# EasyEDA Pro project ID PCB.epro

# Schematic Schematic1
Board Name: Board1; Create Date: 2026-03-27; Page Name: P1; Project Name: ID PCB; Schematic Name: Schematic1; Update Date: 2026-03-29; Company: EasyEDA.com; Page Size: A4; Version: V1.0
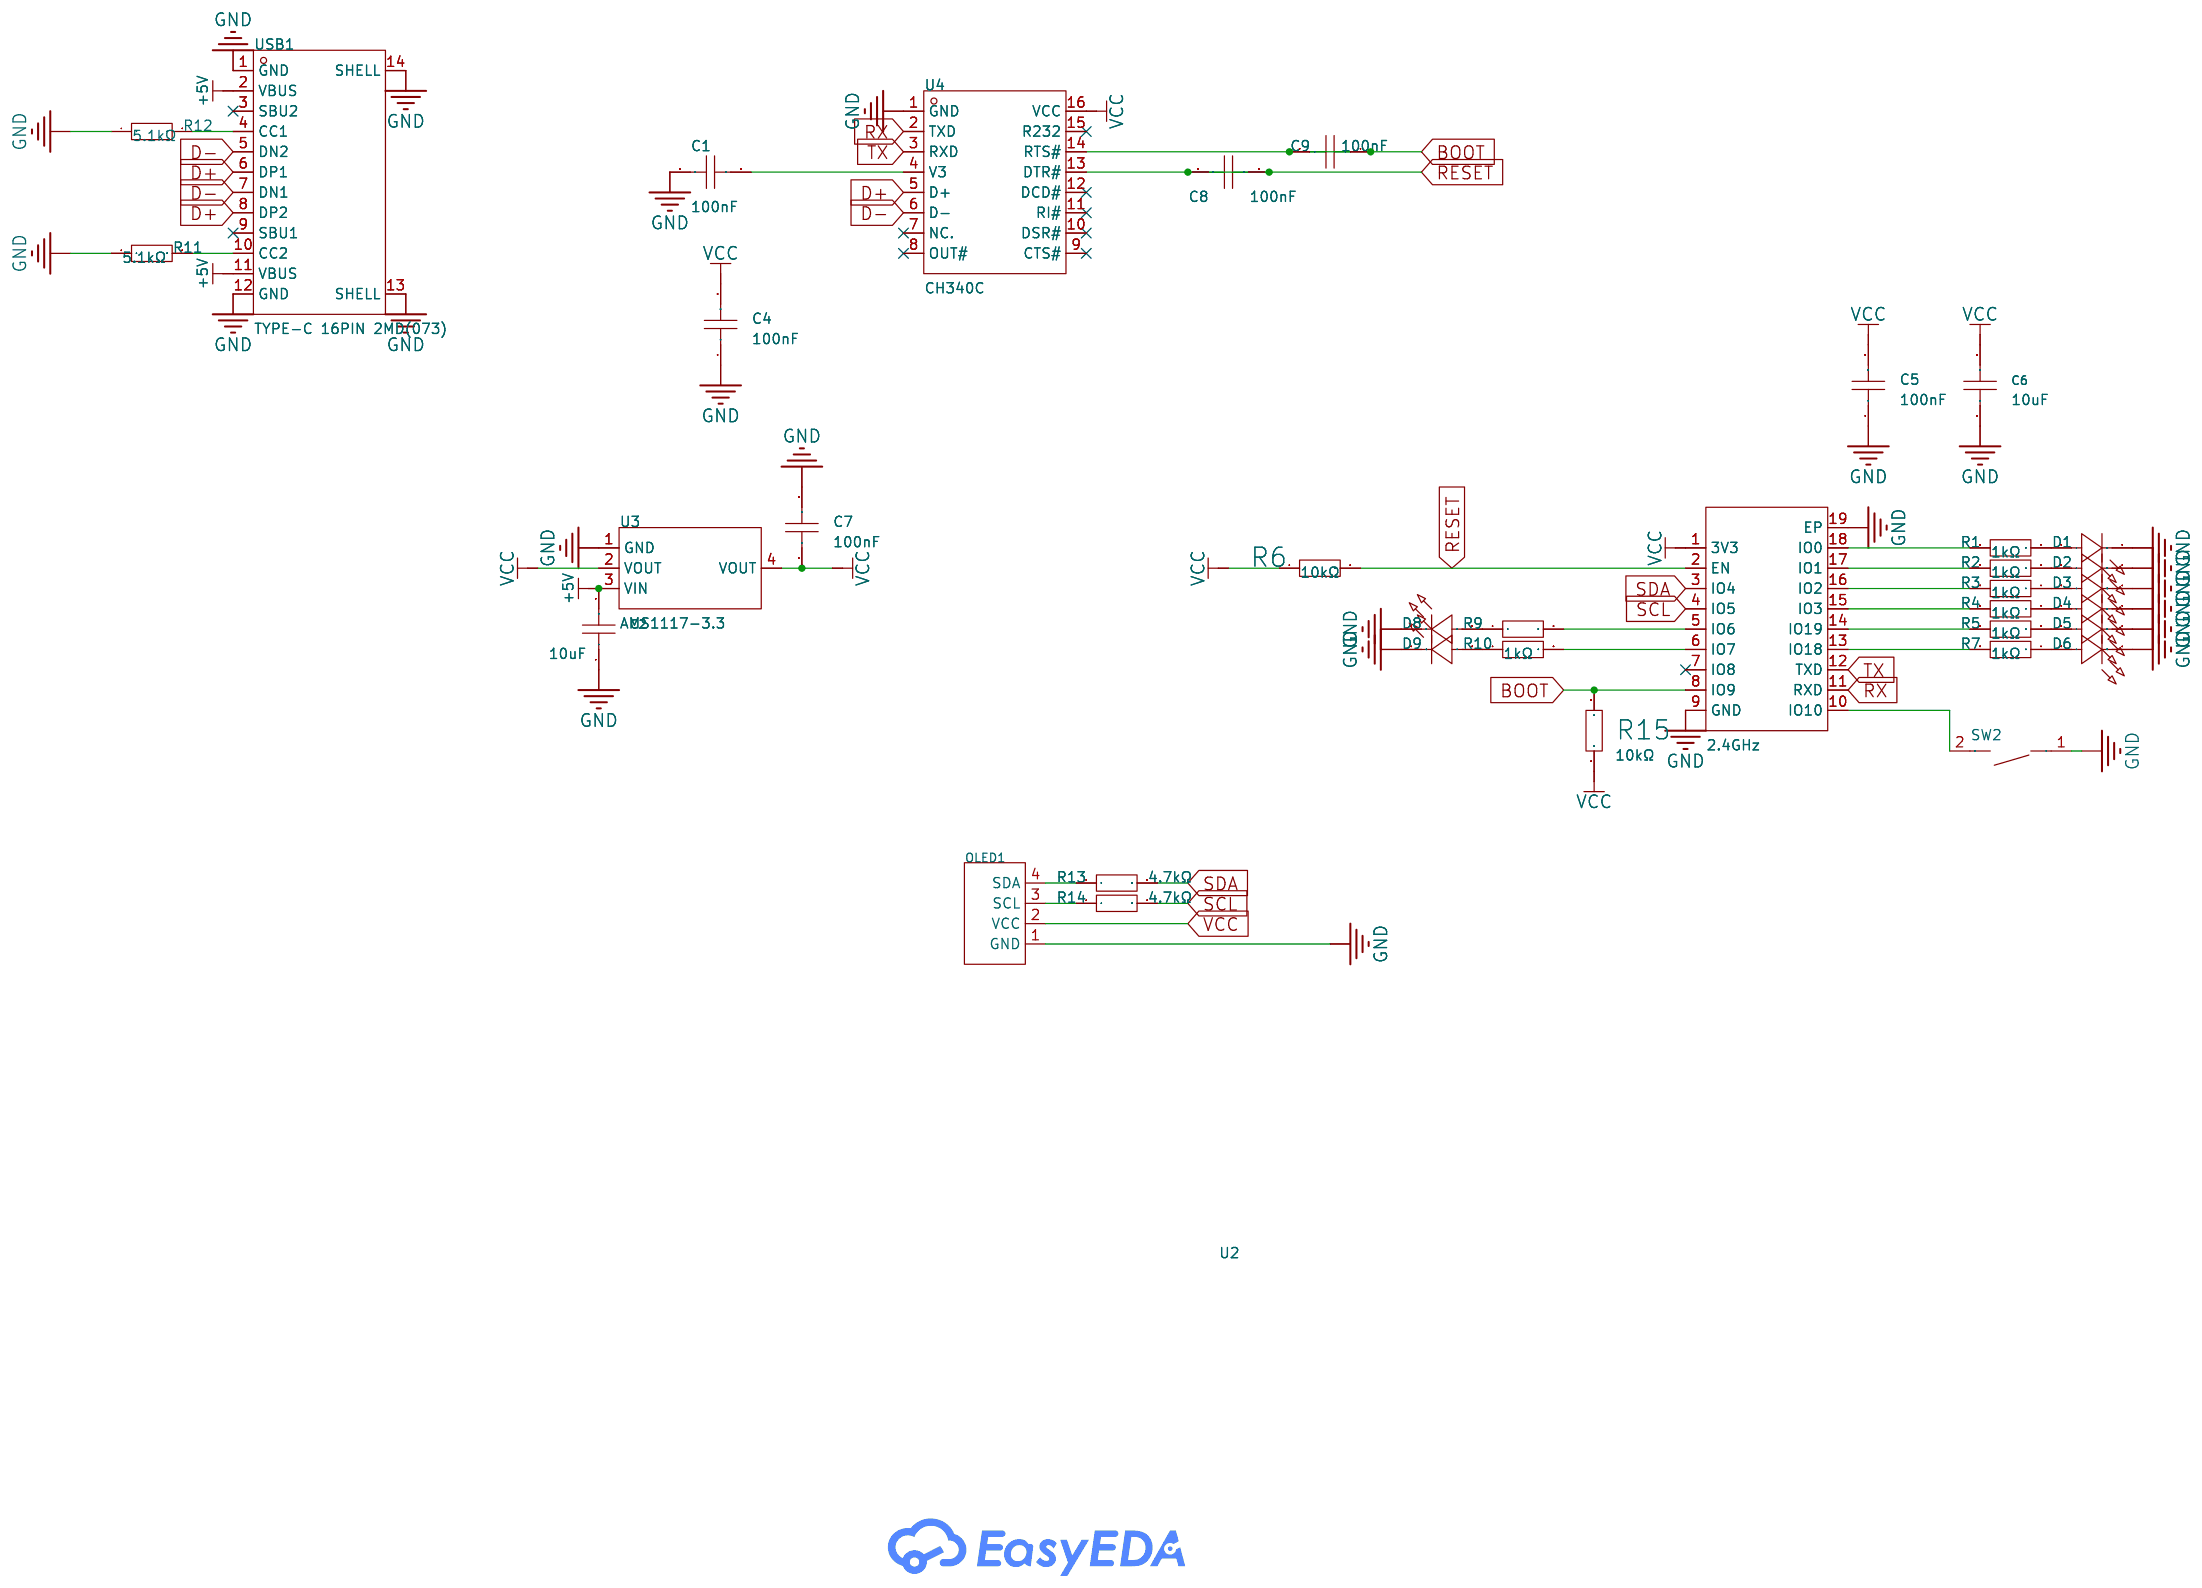
[diagram p0: schematic sheet]

## Parts
C1  100nF  [C0603]
C2  10uF  [C0603]
C4  100nF  [C0603]
C5  100nF  [C0603]
C6  10uF  [C0603]
C7  100nF  [C0603]
C8  100nF  [C0603]
C9  100nF  [C0603]
D1  YLED0603Y  [LED0603-RD-1]
D2  YLED0603Y  [LED0603-RD-1]
D3  YLED0603Y  [LED0603-RD-1]
D4  YLED0603Y  [LED0603-RD-1]
D5  YLED0603Y  [LED0603-RD-1]
D6  YLED0603Y  [LED0603-RD-1]
D8  YLED0603Y  [LED0603-RD-1]
D9  YLED0603Y  [LED0603-RD-1]
OLED1  HS91L02W2C01  [OLED-TH_L38.0-W12.0_HS91L02W2C01]
R1  1kΩ  [R0603]
R2  1kΩ  [R0603]
R3  1kΩ  [R0603]
R4  1kΩ  [R0603]
R5  1kΩ  [R0603]
R6  10kΩ  [R0603]
R7  1kΩ  [R0603]
R9  1kΩ  [R0603]
R10  1kΩ  [R0603]
R11  5.1kΩ  [R0603]
R12  5.1kΩ  [R0603]
R13  4.7kΩ  [R0603]
R14  4.7kΩ  [R0603]
R15  10kΩ  [R0603]
SW2  TS-1088-AR02016  [SW-SMD_L3.9-W3.0-P4.45]
U2  2.4GHz  [BULETM-SMD_ESPRESSIF_ESP32-C3-WROOM-02-N4-4MB]
U3  AMS1117-3.3  [SOT-223-3_L6.5-W3.4-P2.30-LS7.0-BR]
U4  CH340C  [SOP-16_L10.0-W3.9-P1.27-LS6.0-BL]
USB1  TYPE-C 16PIN 2MD(073)  [USB-C-SMD_TYPE-C-6PIN-2MD-073]

## Library data of the parts
C1 C4 C5 C7-C9 = CC0603KRX7R9BB104: Capacitance:100nF Tolerance:±10% Tolerance:±10% Voltage Rating:50V Temperature Coefficient:X7R; LCSC Part Name: 100nF ±10% 50V; Supplier Part: C14663; Manufacturer: YAGEO(国巨); Supplier Footprint: 0603; JLCPCB Part Class: Basic Part; Datasheet: https://item.szlcsc.com/datasheet/CC0603KRX7R9BB104/15331.html; Supplier: LCSC; Tolerance: ±10%; Voltage Rating: 50V; Temperature Coefficient: X7R
C2 C6 = CL10A106MA8NRNC: Capacitance:10uF Tolerance:±20% Tolerance:±20% Voltage Rating:25V Temperature Coefficient:X5R; LCSC Part Name: 10uF ±20% 25V; Supplier Part: C96446; Manufacturer: SAMSUNG(三星); Supplier Footprint: 0603; Datasheet: https://item.szlcsc.com/datasheet/CL10A106MA8NRNC/97651.html; Supplier: LCSC; Tolerance: ±20%; Voltage Rating: 25V; Temperature Coefficient: X5R
D1-D6 D8 D9 = YLED0603Y: Lamp Holder Type:- Illumination Color:Yellow Voltage - Forward(Vf):1.8V~2.4V Voltage - Forward(Vf):1.8V~2.4V Power(Watts):- Forward Current:30mA Wavelength - Dominant:585nm~595nm Wavelength - Dominant:585nm~595nm Peak Wavelength:- Diode Configuration:Disc; LCSC Part Name: 黄色 独立二极管; Supplier Part: C19273152; Manufacturer: YONGYUTAI(永裕泰); Supplier Footprint: 0603; JLCPCB Part Class: Extended Part; Datasheet: https://item.szlcsc.com/datasheet/YLED0603Y/20555406.html; Supplier: LCSC; Illumination Color: Yellow; Voltage - Forward(Vf): 1.8V~2.4V; Forward Current: 30mA; Wavelength - Dominant: 585nm~595nm; Diode Configuration: Discrete Diode; Luminous Intensity: 144mcd; Viewing Angle: 120°; Operating Temperature: -40℃~+85℃
OLED1 = HS91L02W2C01: Controller Type:SSD1306 chip Interface:I2C Size:0.91 Dot Pixels:128x32 Operating Temperature:- Operating Temperature:- Type of Drive:Passive (PMOLED) Display Range:22.384x5.584mm Display Color:White Luminance:150cd/m2 Function:- Quiescent Current:- Voltag; LCSC Part Name: 0.91寸OLED显示屏白光IIC; Supplier Part: C5248081; Manufacturer: HS(汉昇); JLCPCB Part Class: Extended Part; Datasheet: https://item.szlcsc.com/datasheet/HS91L02W2C01/5960632.html; Supplier: LCSC; Controller Type: SSD1306 chip; Interface: I2C; Size: 0.91; Dot Pixels: 128x32; Type of Drive: Passive (PMOLED); Display Range: 22.384x5.584mm; Display Color: White; Luminance: 150cd/m2; Voltage - Supply  For Logic: 1.65V~3.3V
R1-R5 R7 R9 R10 = 0603WAF1001T5E: Type:Thick Film Resistor Resistance:1kΩ Tolerance:±1% Tolerance:±1% Power(Watts):100mW Voltage-Supply(Max):75V Temperature Coefficient:±100ppm/℃ Temperature Coefficient:±100ppm/℃ Operating Temperature:-55℃~+155℃ Operating Temperature:-55℃~+155℃; LCSC Part Name: 1kΩ ±1% 100mW 厚膜电阻; Supplier Part: C21190; Manufacturer: UNI-ROYAL(厚声); Supplier Footprint: 0603; JLCPCB Part Class: Basic Part; Datasheet: https://item.szlcsc.com/datasheet/0603WAF1001T5E/21904.html; Supplier: LCSC; Type: Thick Film Resistor; Tolerance: ±1%; Power(Watts): 100mW; Voltage-Supply(Max): 75V; Temperature Coefficient: ±100ppm/℃; Operating Temperature: -55℃~+155℃
R6 R15 = 0603WAF1002T5E: Type:Thick Film Resistor Resistance:10kΩ Tolerance:±1% Tolerance:±1% Power(Watts):100mW Voltage-Supply(Max):75V Temperature Coefficient:±100ppm/℃ Temperature Coefficient:±100ppm/℃ Operating Temperature:-55℃~+155℃ Operating Temperature:-55℃~+155℃; LCSC Part Name: 厚膜电阻 10kΩ ±1% 100mW; Supplier Part: C25804; Manufacturer: UNI-ROYAL(厚声); Supplier Footprint: 0603; Datasheet: https://item.szlcsc.com/datasheet/0603WAF1002T5E/26547.html; Supplier: LCSC; Type: Thick Film Resistor; Tolerance: ±1%; Power(Watts): 100mW; Voltage-Supply(Max): 75V; Temperature Coefficient: ±100ppm/℃; Operating Temperature: -55℃~+155℃
R11 R12 = 0603WAF5101T5E: Type:Thick Film Resistor Resistance:5.1kΩ Tolerance:±1% Tolerance:±1% Power(Watts):100mW Voltage-Supply(Max):75V Temperature Coefficient:±100ppm/℃ Temperature Coefficient:±100ppm/℃ Operating Temperature:-55℃~+155℃ Operating Temperature:-55℃~+155℃; LCSC Part Name: 5.1kΩ ±1% 100mW 厚膜电阻; Supplier Part: C23186; Manufacturer: UNI-ROYAL(厚声); Supplier Footprint: 0603; JLCPCB Part Class: Basic Part; Datasheet: https://item.szlcsc.com/datasheet/0603WAF5101T5E/23913.html; Supplier: LCSC; Type: Thick Film Resistor; Tolerance: ±1%; Power(Watts): 100mW; Voltage-Supply(Max): 75V; Temperature Coefficient: ±100ppm/℃; Operating Temperature: -55℃~+155℃
R13 R14 = RC0603FR-074K7L: Type:Thick Film Resistor Resistance:4.7kΩ Tolerance:±1% Tolerance:±1% Power(Watts):100mW Voltage-Supply(Max):75V Temperature Coefficient:±100ppm/℃ Temperature Coefficient:±100ppm/℃ Operating Temperature:-55℃~+155℃ Operating Temperature:-55℃~+155℃; LCSC Part Name: 厚膜电阻 4.7kΩ ±1% 100mW; Supplier Part: C99782; Manufacturer: YAGEO(国巨); Supplier Footprint: 0603; JLCPCB Part Class: Extended Part; Datasheet: https://item.szlcsc.com/datasheet/RC0603FR-074K7L/100996.html; Supplier: LCSC; Type: Thick Film Resistor; Tolerance: ±1%; Power(Watts): 100mW; Voltage-Supply(Max): 75V; Temperature Coefficient: ±100ppm/℃; Operating Temperature: -55℃~+155℃
SW2 = TS-1088-AR02016: Circuit:SPST Actuator Style:Round Button Operating Force:1.6N Mounting Type:Surface Mount,Vertical Length:4mm Width:3mm Switch Height:2mm with Bracket:Without Bracket Contact Current:50mA Voltage Rating:12V Actuator/Cap Color:Black Termination Style:SMD(S; LCSC Part Name: 4*3*2mm 立贴 轻触开关; Supplier Part: C720477; Manufacturer: XUNPU(讯普); Supplier Footprint: SMD,4x3mm; JLCPCB Part Class: Basic Part; Datasheet: https://item.szlcsc.com/datasheet/TS-1088-AR02016/763484.html; Supplier: LCSC; Circuit: SPST; Actuator Style: Round Button; Operating Force: 1.6N; Mounting Type: Surface Mount,Vertical; Length: 4mm; Width: 3mm; Switch Height: 2mm; with Bracket: Without Bracket; Contact Current: 50mA; Voltage Rating: 12V; Actuator/Cap Color: Black; Termination Style: SMD(SMT) Tab; Life: 100,000 Cycles; Operating Temperature: -30℃~+80℃
U2 = ESP32-C3-WROOM-02-N4_C2934560: Utilized IC / Part:ESP32-C3 Chip Wireless Standard:Bluetooth5.0 Interface Type:I2S；I2C；JTAG；UART；USB；SPI Frequency:2.4GHz Antenna Type:On-board PCB Antenna Output Power:20.5dBm Output Power:20.5dBm Voltage - Supply:3V~3.6V Voltage - Supply:3V~3.6V Receive; LCSC Part Name: 不带固件 2.4GHz Wi-Fi（802.11b/g/n）+ 蓝牙5模组; Supplier Part: C2934560; Manufacturer: ESPRESSIF(乐鑫); Manufacturer Part: ESP32-C3-WROOM-02-N4; Supplier Footprint: VFQFN-32-EP; JLCPCB Part Class: Extended Part; Datasheet: https://item.szlcsc.com/datasheet/ESP32-C3-WROOM-02-N4/3281215.html; Supplier: LCSC; Utilized IC / Part: ESP32-C3 Chip; Wireless Standard: Bluetooth5.0; Interface Type: I2S；I2C；JTAG；UART；USB；SPI; Antenna Type: On-board PCB Antenna; Output Power: 20.5dBm; Voltage - Supply: 3V~3.6V; Receive  Current: 82mA; Send  Current: 345mA; Sensitivity: -105dBm; Operating Temperature: -40℃~+85℃
U3 = AMS1117-3.3_C6186: Output Type:Fixed Voltage - Supply:15V Output Voltage:3.3V Output Voltage:3.3V Output Current:1A Power Supply Rejection Ratio (PSRR):72dB@(120Hz) Voltage Dropout:1.1V@(800mA) standby current:5mA Noise:0.003%Vout Features:Over Current Protection；Thermal Sh; LCSC Part Name: 3.3V 1A 15V; Supplier Part: C6186; Manufacturer: AMS; Supplier Footprint: SOT-223; JLCPCB Part Class: Basic Part; Datasheet: https://item.szlcsc.com/datasheet/AMS1117-3.3/6652.html; Supplier: LCSC; Output Type: Fixed; Voltage - Supply: 15V; Output Voltage: 3.3V; Output Current: 1A; Power Supply Rejection Ratio (PSRR): 72dB@(120Hz); Voltage Dropout: 1.1V@(800mA); standby current: 5mA; Noise: 0.003%Vout; Features: Over Current Protection；Thermal Shutdown; Operating Temperature: -40℃~+125℃; Output Configuration: Positive; Number of Outputs: 1
U4 = CH340C: Applications Function:Transceiver USB Protocol:USB 2.0 Voltage - Supply:3.3V；5V Voltage - Supply:3.3V；5V Data Rate:2Mbps Operating Temperature:-20℃~+70℃ Operating Temperature:-20℃~+70℃ Current - Supply:7mA Supply Current (Iq):50uA; LCSC Part Name: USB转串口芯片; Supplier Part: C84681; Manufacturer: WCH(南京沁恒); Supplier Footprint: SOP-16; Datasheet: https://item.szlcsc.com/datasheet/CH340C/85852.html; Supplier: LCSC; Applications Function: Transceiver; USB Protocol: USB 2.0; Voltage - Supply: 3.3V；5V; Data Rate: 2Mbps; Operating Temperature: -20℃~+70℃; Current - Supply: 7mA; Supply Current (Iq): 50uA
USB1 = TYPE-C 16PIN 2MD(073): Connector Type:Type-C Protocol Standard:- Gender:Female Mounting Type:Surface Mount, Right Angle Number of Contacts:16P Number of Ports:1 Current Rating-Power:3A Voltage Rating:5V Connect-Disconnect Life:10,000 Cycles Supplementary Features:- Center Heigh; LCSC Part Name: Type-C 母 卧贴; Supplier Part: C2765186; Manufacturer: SHOU HAN(首韩); Supplier Footprint: SMD; Datasheet: https://item.szlcsc.com/datasheet/TYPE-C%252016PIN%25202MD(073)/2901843.html; Supplier: LCSC; Connector Type: Type-C; Gender: Female; Mounting Type: Surface Mount, Right Angle; Number of Contacts: 16P; Number of Ports: 1; Current Rating-Power: 3A; Voltage Rating: 5V; Connect-Disconnect Life: 10,000 Cycles; Detection color: Black; Operating Temperature: -25℃~+85℃

## Nets
+5V: C2.2 U3.3(VIN) USB1.2(VBUS) USB1.11(VBUS)
GND: C1.1 C2.1 C4.1 C5.1 C6.1 C7.2 D1.1(C) D2.1(C) D3.1(C) D4.1(C) D5.1(C) D6.1(C) D8.1(C) D9.1(C) OLED1.1(GND) R11.1 R12.1 SW2.1 U2.9(GND) U2.19(EP) U3.1(GND) U4.1(GND) USB1.1(GND) USB1.12(GND) USB1.13(SHELL) USB1.14(SHELL)
VCC: C4.2 C5.2 C6.2 C7.1 OLED1.2(VCC) R6.1 R15.1 U2.1(3V3) U3.2(VOUT) U3.4(VOUT) U4.16(VCC)
BOOT: C9.1 C9.2 R15.2 U2.8(IO9) U4.14(RTS#)
D+: U4.5(D+) USB1.6(DP1) USB1.8(DP2)
D-: U4.6(D-) USB1.5(DN2) USB1.7(DN1)
RESET: C8.1 C8.2 R6.2 U2.2(EN) U4.13(DTR#)
RX: U2.11(RXD) U4.2(TXD)
SCL: R14.2 U2.4(IO5)
SDA: R13.2 U2.3(IO4)
TX: U2.12(TXD) U4.3(RXD)
$1N3879: SW2.2 U2.10(IO10)
$1N4971: D2.2(A) R2.1
$1N4972: R1.2 U2.18(IO0)
$1N4973: D1.2(A) R1.1
$1N4976: D3.2(A) R3.1
$1N4977: D4.2(A) R4.1
$1N4978: R5.2 U2.14(IO19)
$1N4980: R4.2 U2.15(IO3)
$1N4981: R3.2 U2.16(IO2)
$1N4982: D5.2(A) R5.1
$1N4989: R2.2 U2.17(IO1)
$1N5515: D6.2(A) R7.1
$1N5517: R7.2 U2.13(IO18)
$1N5709: D8.2(A) R9.1
$1N5711: R9.2 U2.5(IO6)
$1N5807: D9.2(A) R10.1
$1N5808: R10.2 U2.6(IO7)
$1N7935: R11.2 USB1.10(CC2)
$1N7974: R12.2 USB1.4(CC1)
$1N8131: C1.2 U4.4(V3)
$1N9866: OLED1.4(SDA) R13.1
$1N9908: OLED1.3(SCL) R14.1

Not connected (* = marked no-connect by the designer): U2 7(IO8)*; U4 7(NC.)* 8(OUT#)* 9(CTS#)* 10(DSR#)* 11(RI#)* 12(DCD#)* 15(R232)*; USB1 3(SBU2)* 9(SBU1)*

# Board PCB1
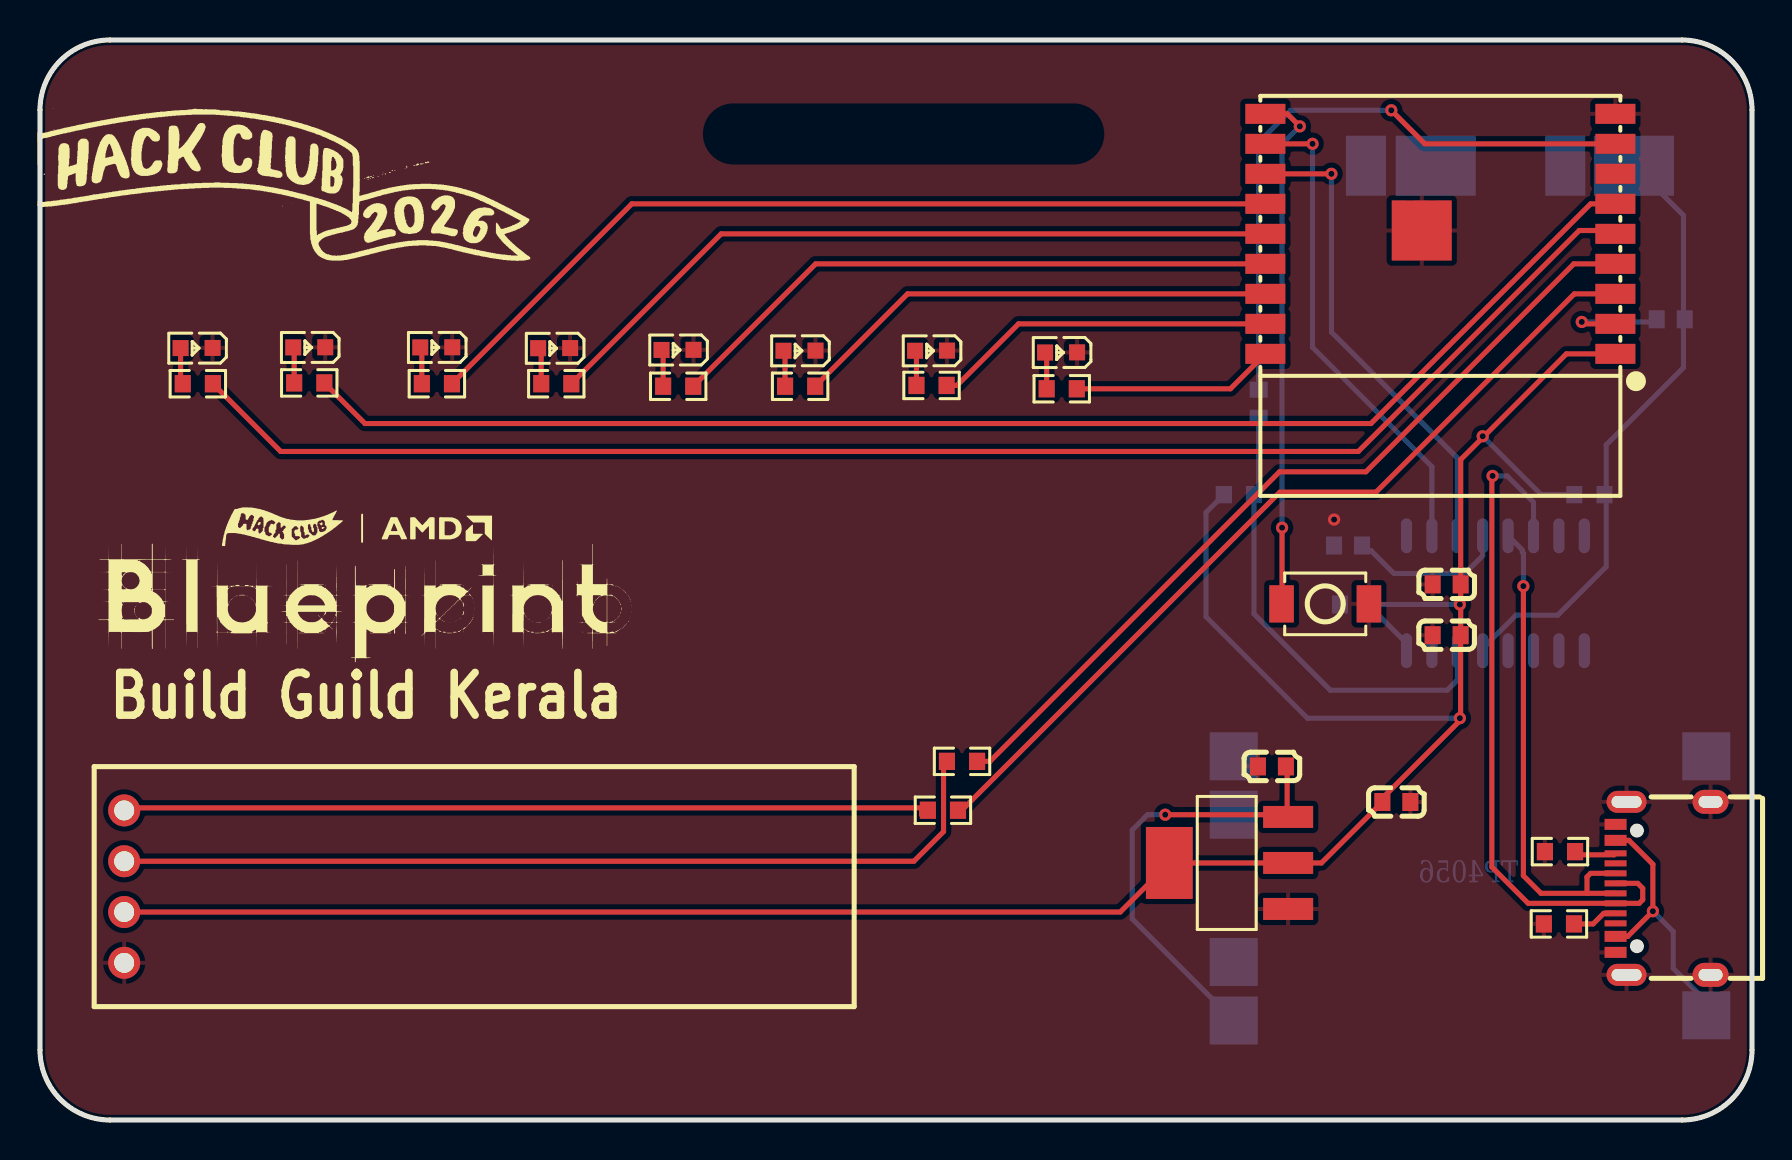
[diagram p1: board, top side]
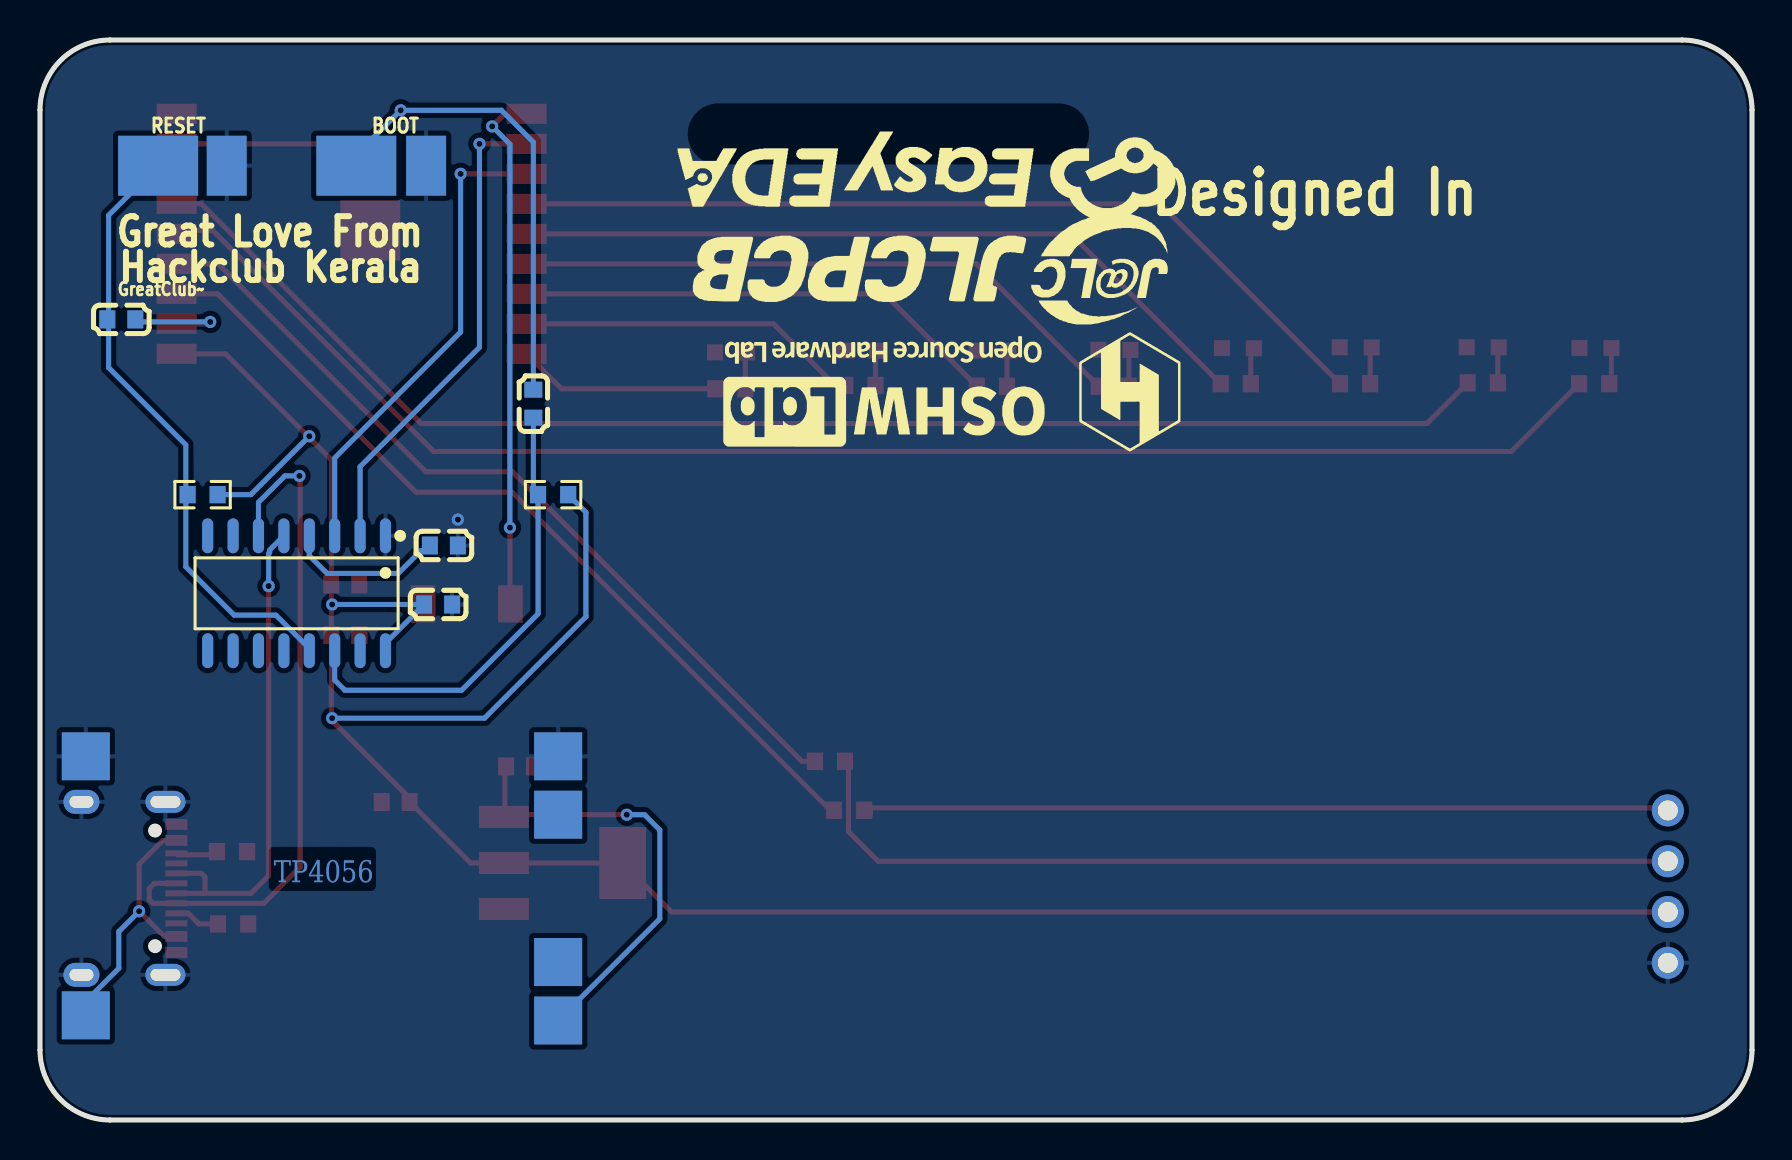
[diagram p2: board, bottom side, seen from below]

Outline 85.6 x 54 mm; copper layers: Top Layer, Bottom Layer. Coordinates in mm from the lower left corner of the outline.
Outline path: 0,50.5 0,3.5 arc(1.03,1.03) 3.5,0 82.1,0 arc(84.57,1.03) 85.6,3.5 85.6,50.5 arc(84.57,52.97) 82.1,54 3.5,54 arc(1.03,52.97) 0,50.5
Stack: Top Layer 0.035mm / Dielectric1 1.51mm FR4 er 4.5 / Bottom Layer 0.035mm

## Design rules (mm)
template: JLCPCB Capability(Two Layers Board)
spacing copperThickness1oz (default): track to track 0.102, other pairs 0.152 to 0.3
spacing copperThickness2oz: track to track 0.203, other pairs 0.152 to 0.3
track width copperThickness1oz (default): min 0.127, default 0.254, max 2.54
track width copperThickness2oz: min 0.203, default 0.254, max 2.54
differential pair differentialPair (default): width min 0.127, default 0.254, max 2.54; gap min 0.152, default 0.152
via viaSize (default): diameter min 0.5, default 0.61, max 10; hole min 0.3, default 0.305, max 6.3

## Placement (name value [footprint] x y rotation side)
C1  100nF  [C0603]  65.41 28.73 0 bottom
C2  10uF  [C0603]  61.59 17.68 0 top
C4  100nF  [C0603]  65.69 25.78 0 bottom
C5  100nF  [C0603]  70.34 26.78 0 top
C6  10uF  [C0603]  70.33 24.24 0 top
C7  100nF  [C0603]  67.82 15.9 0 top
C8  100nF  [C0603]  81.53 40.03 0 bottom
C9  100nF  [C0603]  60.93 35.82 90 bottom
D1  YLED0603Y  [LED0603-RD-1]  51.05 38.38 180 top
D2  YLED0603Y  [LED0603-RD-1]  44.55 38.47 180 top
D3  YLED0603Y  [LED0603-RD-1]  37.97 38.47 180 top
D4  YLED0603Y  [LED0603-RD-1]  31.88 38.51 180 top
D5  YLED0603Y  [LED0603-RD-1]  25.71 38.59 180 top
D6  YLED0603Y  [LED0603-RD-1]  19.81 38.63 180 top
D8  YLED0603Y  [LED0603-RD-1]  7.83 38.6 180 top
D9  YLED0603Y  [LED0603-RD-1]  13.46 38.63 180 top
NOREF  -  [Pad_e1001]  59.69 7.9 270 top
NOREF#2  -  [Pad_e28]  66.29 47.71 0 top
NOREF#3  -  [Pad_e1003]  59.69 4.98 270 top
NOREF#4  -  [Pad_e1000]  59.69 15.27 270 top
NOREF#5  -  [Pad_e999]  59.69 18.19 270 top
NOREF#6  -  [Pad_e102]  69.09 44.47 270 top
NOREF#7  -  [Pad_e1002]  83.31 5.23 270 top
NOREF#8  -  [Pad_e30]  69.79 47.71 180 top
NOREF#9  -  [Pad_e256]  79.69 47.71 180 top
NOREF#10  -  [Pad_e33]  76.26 47.71 0 top
NOREF#11  -  [Pad_e998]  83.31 18.19 270 top
OLED1  HS91L02W2C01  [OLED-TH_L38.0-W12.0_HS91L02W2C01]  4.21 11.67 0 top
R1  1kΩ  [R0603]  51.09 36.56 0 top
R2  1kΩ  [R0603]  44.58 36.73 0 top
R3  1kΩ  [R0603]  38.01 36.69 0 top
R4  1kΩ  [R0603]  31.91 36.69 0 top
R5  1kΩ  [R0603]  25.81 36.81 0 top
R6  10kΩ  [R0603]  77.47 31.27 0 bottom
R7  1kΩ  [R0603]  19.84 36.81 0 top
R9  1kΩ  [R0603]  7.89 36.81 0 top
R10  1kΩ  [R0603]  13.46 36.86 0 top
R11  5.1kΩ  [R0603]  76 13.42 0 top
R12  5.1kΩ  [R0603]  75.95 9.8 0 top
R13  4.7kΩ  [R0603]  45.15 15.49 0 top
R14  4.7kΩ  [R0603]  46.1 17.93 0 top
R15  10kΩ  [R0603]  59.94 31.27 0 bottom
SW2  TS-1088-AR02016  [SW-SMD_L3.9-W3.0-P4.45]  64.26 25.81 180 top
U2  2.4GHz  [BULETM-SMD_ESPRESSIF_ESP32-C3-WROOM-02-N4-4MB]  70.02 44.31 180 top
U3  AMS1117-3.3  [SOT-223-3_L6.5-W3.4-P2.30-LS7.0-BR]  59.44 12.85 0 top
U4  CH340C  [SOP-16_L10.0-W3.9-P1.27-LS6.0-BL]  72.77 26.34 0 bottom
USB1  TYPE-C 16PIN 2MD(073)  [USB-C-SMD_TYPE-C-6PIN-2MD-073]  81.15 11.58 90 top

## Footprints (pads in the part's own frame, mm; a bottom-side part is the same pattern mirrored in y, then rotated)
BULETM-SMD_ESPRESSIF_ESP32-C3-WROOM-02-N4-4MB
  rect 2x1 smd: 1(-8.75,6) 2(-8.75,4.5) 3(-8.75,3) 4(-8.75,1.5) 5(-8.75,0) 6(-8.75,-1.5) 7(-8.75,-3) 8(-8.75,-4.5) 9(-8.75,-6) 10(8.75,-6) 11(8.75,-4.5) 12(8.75,-3) 13(8.75,-1.5) 14(8.75,0) 15(8.75,1.5) 16(8.75,3) 17(8.75,4.5) 18(8.75,6)
  rect 0.7x0.7 smd: 19(-0.14,0.9) 19(-0.14,-0.2) 19(-0.14,-1.3) 19(0.96,0.9) 19(0.96,-0.2) 19(0.96,-1.3) 19(2.06,0.9) 19(2.06,-0.2) 19(2.06,-1.3)
C0603
  rect 0.8x0.9 smd: 1(-0.7,0) 2(0.7,0)
LED0603-RD-1
  rect 0.8x0.8 smd: 1(-0.799,-0.004) 2(0.799,0.004)
OLED-TH_L38.0-W12.0_HS91L02W2C01
  round 1.6 hole 1: 1(0,-3.81) 2(0,-1.27) 3(0,1.27) 4(0,3.81)
Pad_e28
  rect 2x3 smd far side: 1(0,0)
Pad_e30
  rect 4x3 smd far side: 1(0,0)
Pad_e33
  rect 2x3 smd far side: 1(0,0)
Pad_e102
  rect 3x3 smd: 1(0,0)
Pad_e256
  rect 4x3 smd far side: 1(0,0)
Pad_e998
  rect 2.4x2.4 smd far side: 02(0,0)
Pad_e999
  rect 2.4x2.4 smd far side: 02(0,0)
Pad_e1000
  rect 2.4x2.4 smd far side: 02(0,0)
Pad_e1001
  rect 2.4x2.4 smd far side: (0,0)
Pad_e1002
  rect 2.4x2.4 smd far side: 02(0,0)
Pad_e1003
  rect 2.4x2.4 smd far side: 02(0,0)
R0603
  rect 0.806x0.864 smd: 1(-0.753,0) 2(0.753,0)
SOP-16_L10.0-W3.9-P1.27-LS6.0-BL
  oval 0.56x1.745 smd: 1(-4.445,-2.873) 2(-3.175,-2.873) 3(-1.905,-2.873) 4(-0.635,-2.873) 5(0.635,-2.873) 6(1.905,-2.873) 7(3.175,-2.873) 8(4.445,-2.873) 9(4.445,2.873) 10(3.175,2.873) 11(1.905,2.873) 12(0.635,2.873) 13(-0.635,2.873) 14(-1.905,2.873) 15(-3.175,2.873) 16(-4.445,2.873)
SOT-223-3_L6.5-W3.4-P2.30-LS7.0-BR
  rect 2.5x1.1 smd: 1(2.97,-2.3) 2(2.97,0) 3(2.97,2.3)
  rect 2.34x3.6 smd: 4(-2.97,0)
SW-SMD_L3.9-W3.0-P4.45
  rect 1.23x1.86 smd: 1(-2.185,0) 2(2.185,0)
USB-C-SMD_TYPE-C-6PIN-2MD-073
  rect 0.55x1.1 smd: 1(-3.2,2.375) 2(-2.4,2.375) 11(2.4,2.375) 12(3.2,2.375)
  rect 0.3x1.1 smd: 3(-1.75,2.375) 4(-1.25,2.375) 5(-0.75,2.375) 6(-0.25,2.375) 7(0.25,2.375) 8(0.75,2.375) 9(1.25,2.375) 10(1.75,2.375)
  oval 1.1x2 hole 0.6x1.5: 13(-4.325,1.825) 14(4.325,1.825)
  oval 1.2x1.8 hole 0.6x1.2: 13(-4.325,-2.375) 14(4.325,-2.375)

## Nets
As in the schematic, except:
+5V: C2.2 NOREF#3.02 U3.3
GND: C1.1 C2.1 C4.1 C5.1 C6.1 C7.2 D1.1 D2.1 D3.1 D4.1 D5.1 D6.1 D8.1 D9.1 NOREF#2.1 NOREF#5.02 NOREF#6.1 NOREF#10.1 NOREF#11.02 OLED1.1 R11.1 R12.1 SW2.1 U2.9 U2.19 U3.1 U4.1 USB1.1 USB1.12 USB1.13 USB1.14
VBUS: NOREF#7.02 USB1.2 USB1.11
BOOT: C9.1 C9.2 NOREF#8.1 R15.2 U2.8 U4.14
RESET: C8.1 C8.2 NOREF#9.1 R6.2 U2.2 U4.13

Pads without a net: U2 7; U4 7 8 9 10 11 12 15; USB1 3 9

## Via types
v1: diameter 0.61, hole 0.305, Top Layer to Bottom Layer, 14 vias

## Routing (per net, layer and track width the routed paths; a pad name or vN(x,y) marks a point on that pad's centre or on a via; arc(x,y) is an arc through that point)
+5V: length 22.3
  Top Layer w0.254: 62.36,15.2 U3.3 ; 62.36,15.2 62.29,15.27 v1(56.26,15.27) ; 62.36,15.2 62.36,17.62 C2.2
  Bottom Layer w0.254: v1(56.26,15.27) 55.37,15.27 54.61,14.5 54.61,10.06 NOREF#3.02
GND:
  vias: v1(64.71,30.02)
VBUS: length 13.4
  Top Layer w0.254: USB1.2 79.39,9.18 v1(80.65,10.44) 80.65,12.79 79.45,13.98 USB1.11
  Bottom Layer w0.254: NOREF#7.02 83.31,5.93 81.66,7.58 81.66,9.42 v1(80.65,10.44)
VCC: length 128.6
  Top Layer w0.254: U2.1 76.32,38.31 71.03,33.02 C5.2 71.03,24.24 C6.2 71.03,20 67.12,16.09 C7.1 64.07,12.85 U3.2 U3.4 54.01,10.4 OLED1.2
  Bottom Layer w0.254: v1(72.14,34.19) 75.06,31.27 R6.1 ; v1(70.99,20.09) 63.37,20.09 58.3,25.16 58.3,30.38 R15.1 ; U4.16 68.33,23.84 C4.2 v1(70.99,25.78)
BOOT: length 58.6
  Top Layer w0.254: U2.8 69.24,48.81 v1(67.56,50.49)
  Bottom Layer w0.254: NOREF#8.1 69.79,48.26 v1(67.56,50.49) 62.53,50.49 60.93,48.89 C9.2 ; C9.1 60.93,31.5 R15.2 60.7,25.31 64.52,21.49 70.36,21.49 70.87,22 U4.14
D+: length 24.6
  Top Layer w0.254: USB1.6 77.35,11.33 ; 77.35,11.33 77.35,12.15 77.53,12.33 USB1.8 ; 77.35,11.33 75.05,11.33 74.17,12.22 v1(74.17,26.69)
  Bottom Layer w0.254: U4.5 74.12,28.5 74.12,28.38 74.17,28.33 v1(74.17,26.69)
D-: length 34.2
  Top Layer w0.254: USB1.7 79.89,11.83 80.14,11.58 80.14,11.01 79.96,10.83 USB1.5 74.41,10.83 72.59,12.65 72.59,32.17 v1(72.63,32.2)
  Bottom Layer w0.254: U4.6 74.68,30.89 73.36,32.2 v1(72.63,32.2)
RESET: length 36.3
  Top Layer w0.254: U2.2 77.18,39.81 v1(77.09,39.9)
  Bottom Layer w0.254: 82.17,40.09 82.17,37.62 78.31,33.76 78.31,27.66 75.89,25.24 73.8,25.24 72.14,23.58 U4.13 ; 82.17,40.09 C8.2 ; 82.17,40.09 82.17,45.24 NOREF#9.1 ; v1(77.09,39.9) 80.71,39.9 C8.1
RX: length 24.4
  Top Layer w0.254: U2.11 v1(63.63,48.81)
  Bottom Layer w0.254: U4.2 69.6,32.66 63.63,38.63 v1(63.63,48.81)
SCL: length 42.2
  Top Layer w0.254: R14.2 47.5,17.93 61.98,32.41 66.29,32.41 76.69,42.81 U2.4
SDA: length 43.2
  Top Layer w0.254: U2.3 76.72,41.31 66.8,31.39 61.99,31.39 46.21,15.61
TX: length 24.5
  Top Layer w0.254: U2.12 v1(64.57,47.31)
  Bottom Layer w0.254: 70.87,28.71 U4.3 70.87,33.1 64.57,39.39 v1(64.57,47.31)
$1N3879: length 26.2
  Top Layer w0.254: U2.10 62.37,50.31 v1(62.99,49.68) ; v1(62.1,29.62) 62.1,25.83 SW2.2
  Bottom Layer w0.254: v1(62.99,49.68) 62.1,48.79 v1(62.1,29.62)
$1N4971: length 1.8
  Top Layer w0.254: R2.1 43.82,38.39 D2.2
$1N4972: length 10.2
  Top Layer w0.254: R1.2 59.52,36.56 U2.18
$1N4973: length 1.8
  Top Layer w0.254: R1.1 50.33,38.3 D1.2
$1N4976: length 1.8
  Top Layer w0.254: D3.2 37.25,38.39 R3.1
$1N4977: length 1.8
  Top Layer w0.254: D4.2 31.16,38.42 R4.1
$1N4978: length 37.8
  Top Layer w0.254: R5.2 34.06,44.31 U2.14
$1N4980: length 31.1
  Top Layer w0.254: U2.15 38.78,42.81 R4.2
$1N4981: length 24.4
  Top Layer w0.254: U2.16 43.38,41.31 R3.2
$1N4982: length 1.8
  Top Layer w0.254: D5.2 25.06,38.44 R5.1
$1N4989: length 17.2
  Top Layer w0.254: R2.2 45.85,36.73 48.93,39.81 U2.17
$1N5515: length 1.8
  Top Layer w0.254: D6.2 19.09,38.55 R7.1
$1N5517: length 44.4
  Top Layer w0.254: R7.2 29.59,45.81 U2.13
$1N5709: length 1.8
  Top Layer w0.254: R9.1 7.03,36.92 D8.2
$1N5711: length 76.2
  Top Layer w0.254: U2.5 78.6,44.47 76.96,44.47 65.91,33.43 12.03,33.43 R9.2
$1N5807: length 1.8
  Top Layer w0.254: R10.1 12.71,38.58 D9.2
$1N5808: length 69.9
  Top Layer w0.254: U2.6 77.53,45.81 66.55,34.82 16.25,34.82 R10.2
$1N7935: length 2.1
  Top Layer w0.254: R11.2 76.91,13.26 78.71,13.26 USB1.10
$1N7974: length 2.6
  Top Layer w0.254: USB1.4 78.18,10.33 77.66,9.8 76.45,9.8
$1N8131: length 7.6
  Bottom Layer w0.254: 66.36,28.47 66.55,28.47 67.69,27.33 71.25,27.33 72.14,28.22 U4.4
$1N9866: length 41.1
  Top Layer w0.254: 44.08,15.61 4.34,15.61 OLED1.4 ; 44.08,15.61 44.08,15.27 44.42,15.27 44.08,15.61
$1N9908: length 45.2
  Top Layer w0.254: R14.1 45.18,17.76 45.18,14.42 43.7,12.94 OLED1.3

## Copper pours and planes (outline as drawn; the poured copper is in the pictures)
GND on Top Layer: -1.14,62.38 94.74,62.38 94.74,-0.99 -1.14,-0.99
GND on Bottom Layer: -17.91,68.86 98.04,68.86 98.04,-11.66 -17.91,-11.66

## Text on the board
Bottom Layer: TP4056
Bottom Silkscreen Layer: GreatClub~ | BOOT | RESET | Great Love From | Hackclub Kerala | Designed In
Top Silkscreen Layer: Build Guild Kerala
